# EAGLE schematic lab1 Eagle (EAGLE 9.3.0)
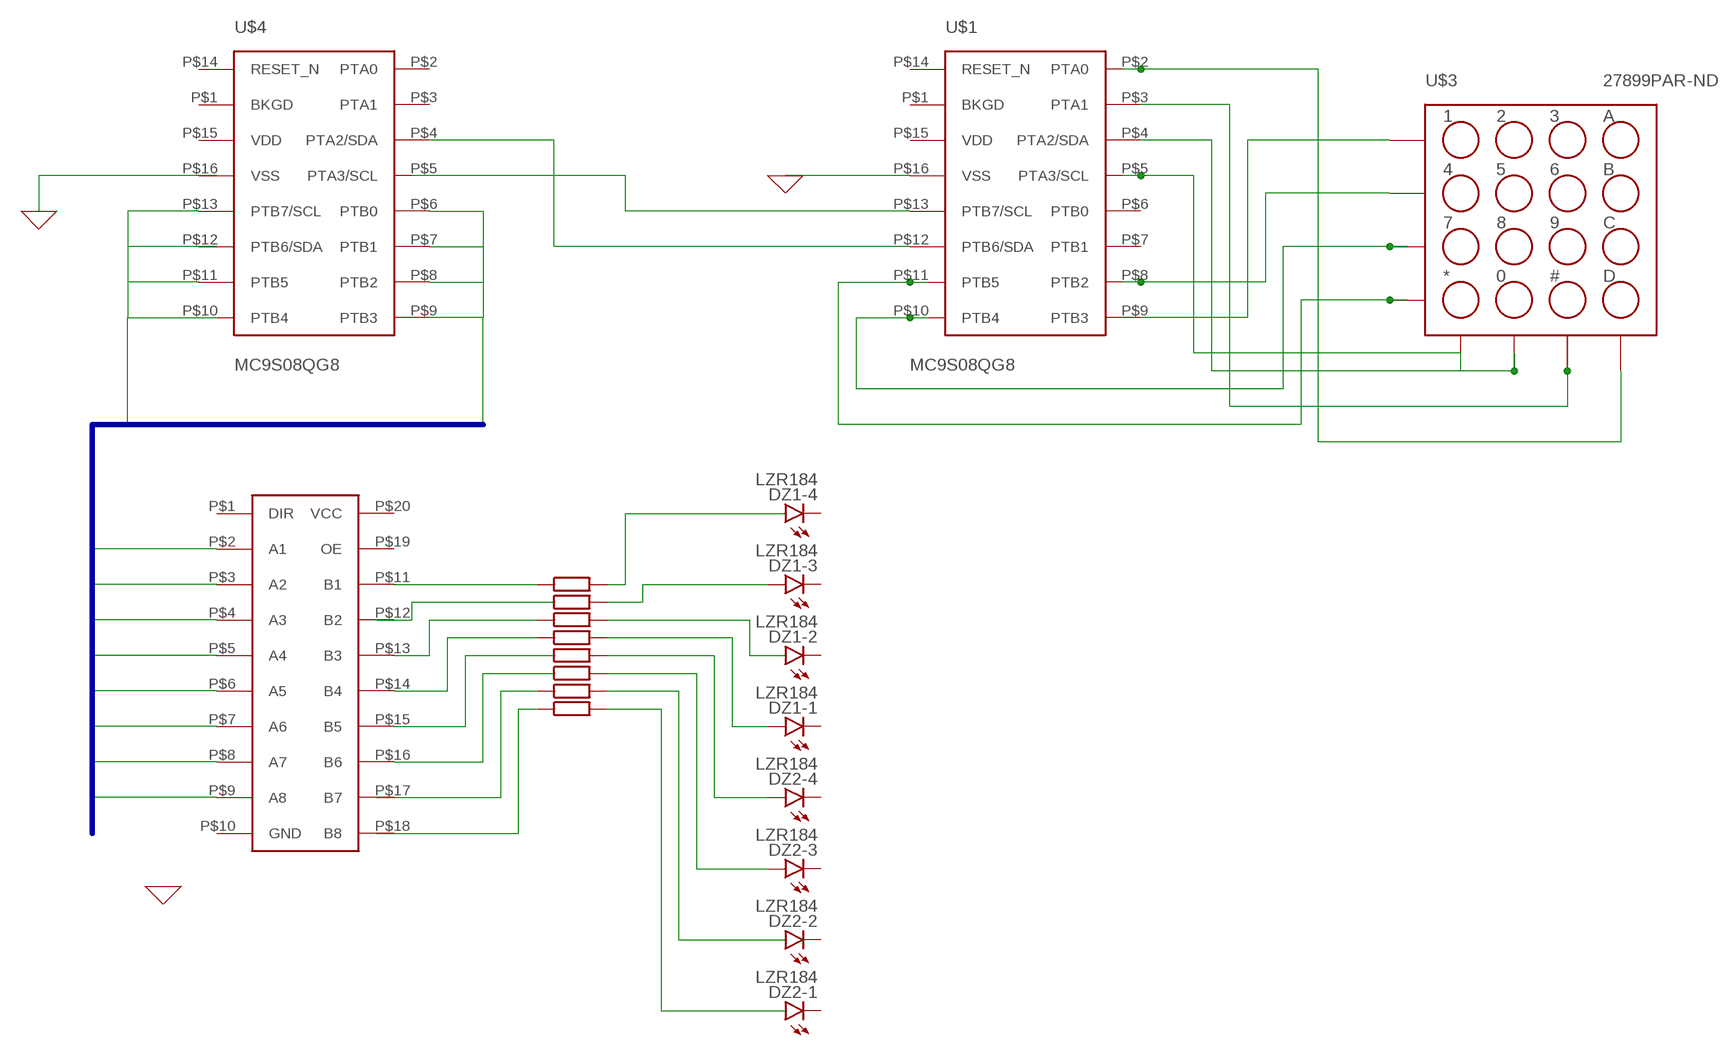
[diagram p0: schematic, sheet 1]

## Parts
DZ1  LZR184  [LZR184]
DZ2  LZR184  [LZR184]
U$1  MC9S08QG8  [MC9S08QG8]
U$3  27899PAR-ND  [27899PAR-ND]
U$4  MC9S08QG8  [MC9S08QG8]
U$5  SN74HC245  [SN74HC245]

## Nets
0: U$1.P$16(VSS) ; supply symbol labelled GND
N$1: U$1.P$9(PTB3) U$3.P$1
N$2: U$1.P$8(PTB2) U$3.P$2
N$3: U$1.P$10(PTB4) U$3.P$3
N$4: U$1.P$11(PTB5) U$3.P$4
N$5: U$1.P$5(PTA3/SCL) U$3.P$8
N$6: U$1.P$4(PTA2/SDA) U$3.P$7
N$7: U$1.P$3(PTA1) U$3.P$6
N$8: U$1.P$2(PTA0) U$3.P$5
N$9: U$4.P$6(PTB0) U$4.P$7(PTB1) U$4.P$8(PTB2) U$4.P$9(PTB3)
N$10: U$4.P$11(PTB5) U$4.P$13(PTB7/SCL)
N$11: U$1.P$13(PTB7/SCL)
N$12: U$5.P$2(A1)
N$13: U$5.P$3(A2)
N$14: U$5.P$4(A3)
N$15: U$5.P$5(A4)
N$16: U$5.P$6(A5)
N$17: U$5.P$7(A6)
N$18: U$5.P$8(A7)
N$19: U$5.P$9(A8)
N$20: U$1.P$12(PTB6/SDA) U$4.P$4(PTA2/SDA)
N$21: U$5.P$11(B1)
N$23: U$5.P$13(B3)
N$24: U$5.P$14(B4)
N$25: U$5.P$15(B5)
N$26: U$5.P$16(B6)
N$30: DZ1.A3(-3:A)
N$32: DZ1.A1(-1:A)
N$33: DZ2.A4(-4:A)
N$34: DZ2.A3(-3:A)
Unconnected: DZ1.A2(-2:A) DZ1.A4(-4:A) DZ1.K1(-1:C) DZ1.K2(-2:C) DZ1.K3(-3:C) DZ1.K4(-4:C) DZ2.A1(-1:A) DZ2.A2(-2:A) DZ2.K1(-1:C) DZ2.K2(-2:C) DZ2.K3(-3:C) DZ2.K4(-4:C) U$1.P$1(BKGD) U$1.P$6(PTB0) U$1.P$7(PTB1) U$1.P$14(RESET_N) U$1.P$15(VDD) U$4.P$1(BKGD) U$4.P$2(PTA0) U$4.P$3(PTA1) U$4.P$5(PTA3/SCL) U$4.P$10(PTB4) U$4.P$12(PTB6/SDA) U$4.P$14(RESET_N) U$4.P$15(VDD) U$4.P$16(VSS) U$5.P$1(DIR) U$5.P$10(GND) U$5.P$12(B2) U$5.P$17(B7) U$5.P$18(B8) U$5.P$19(OE) U$5.P$20(VCC)

## Buses
B$1

## Library data of the parts
DZ1 DZ2 = led:LZR184: LED BLOCK 4 LEDs, Siemens
U$1 U$4 = EELE_465:MC9S08QG8
U$3 = EELE_465:27899PAR-ND
U$5 = EELE_465:SN74HC245